# EAGLE design PortableWiFiRepeaterUSBPowerOnly (EAGLE 9.6.2)
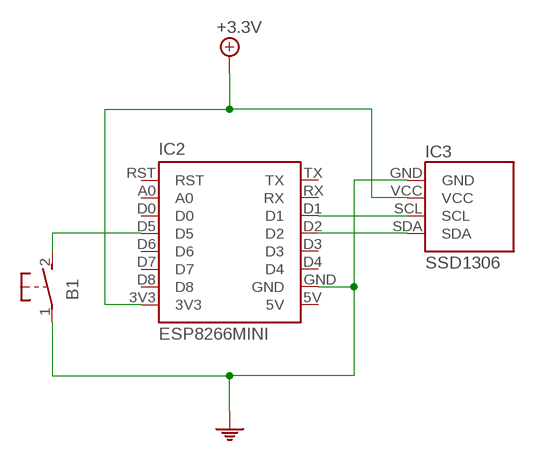
[diagram p0: schematic, sheet 1]

## Parts
B1  BUTTONSIL2  [SIL2]
IC2  ESP8266MINI  [ESP8266MINI]
IC3  SSD1306  [SSD1306]

## Nets
+3.3V: IC2.3V3 IC3.VCC
GND: B1.1(P) IC2.GND IC3.GND
N$2: B1.2(S) IC2.D5
N$3: IC2.D1 IC3.SCL
N$4: IC2.D2 IC3.SDA
Unconnected: IC2.A0 IC2.D0 IC2.D3 IC2.D4 IC2.D6 IC2.D7 IC2.D8 IC2.RST IC2.RX IC2.TX

## Power pins joined to a net without a drawn wire
5V: IC2.5V

## Library data of the parts
B1 = wizzent:BUTTON: Button
IC2 = wizzent:ESP8266MINI: ESP8266 Mini
IC3 = wizzent:SSD1306: SSD1306

## Board
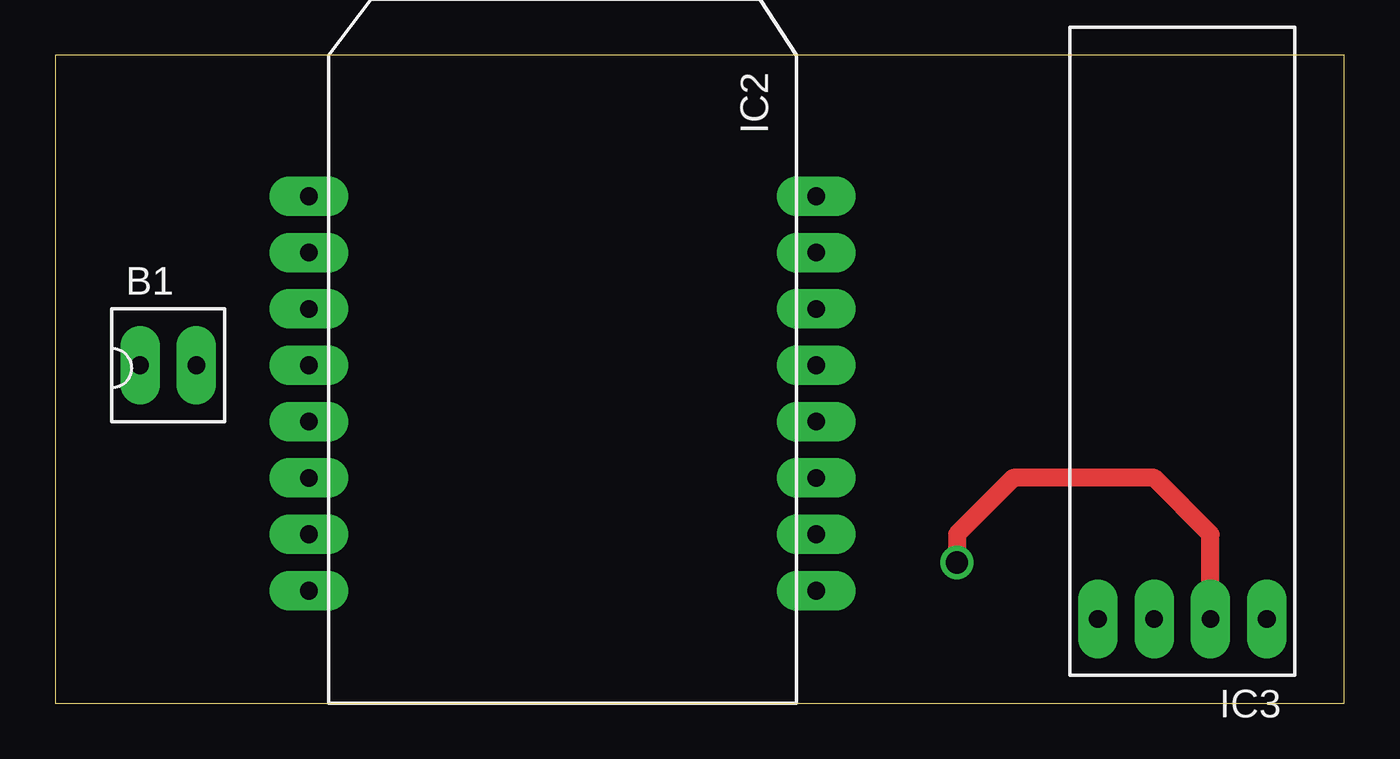
[diagram p1: board, top side]
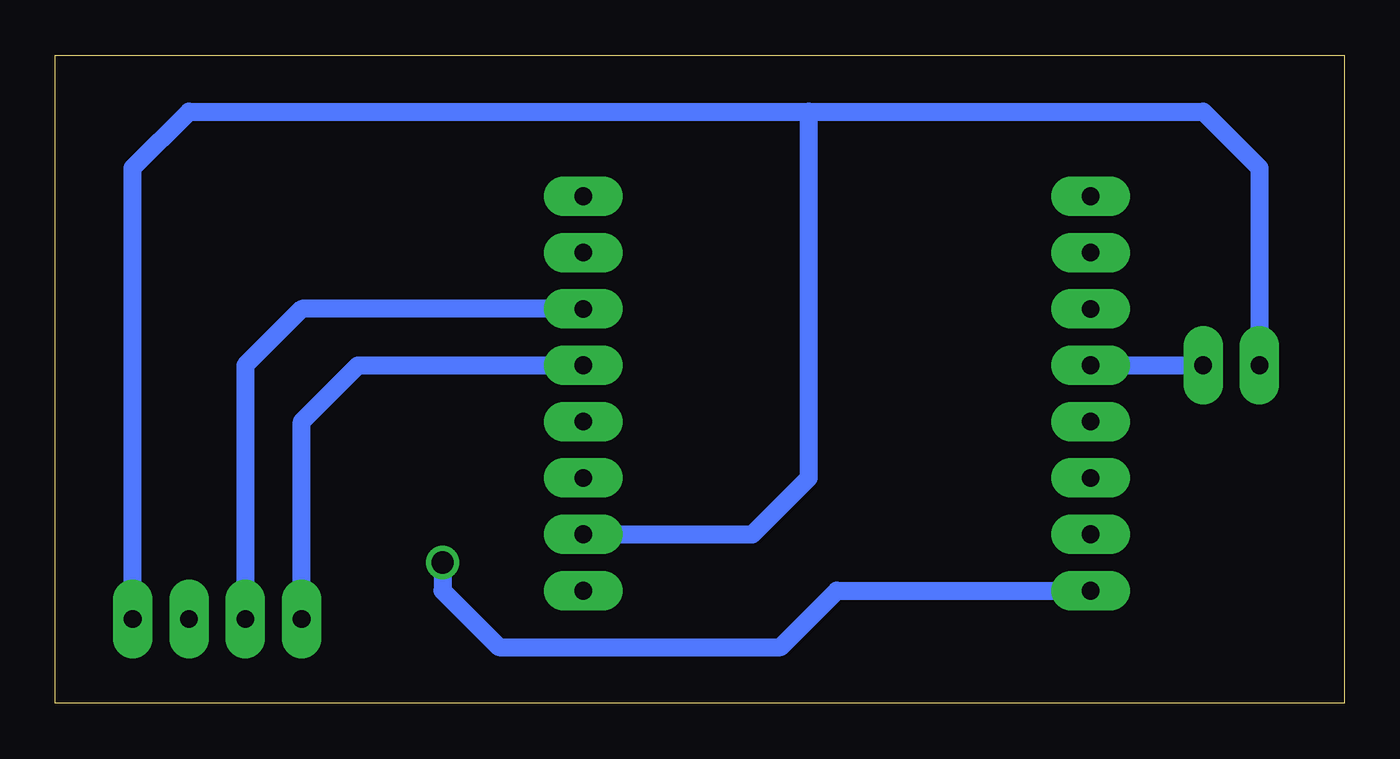
[diagram p2: board, bottom side, seen from below]

Size 58.09 x 29.2 mm. Coordinates in mm from the lower left corner, seen from the top.
Outline: 0,0 58.09,0 58.09,29.2 0,29.2 0,0
Copper layers (1*16): Top 0.035mm / dielectric 1.5mm / Bottom 0.035mm
Design rules "default": minimum track width 6mil, minimum drill 0.35mm, track to track 6mil, track to pad 6mil, pad to pad 6mil, via to via 6mil, smd to smd 6mil, copper to edge 40mil, drill to drill 6mil, minimum pad ring 10mil, minimum via ring 8mil, stop-mask expansion 4mil, vias tented up to drill 0mil, thermal gap 10mil

### Footprints (pad centres in the part's own frame; a part is rotated, then mirrored left to right if it is on the bottom)
SIL2 = drill 0.8 pad 1.778 long: 1 0,0; 2 2.54,0
ESP8266MINI = drill 0.8 pad 1.778 long: 3V3 17.78,0; 5V 17.78,22.86; A0 2.54,0; D0 5.08,0; D1 5.08,22.86; D2 7.62,22.86; D3 10.16,22.86; D4 12.7,22.86; D5 7.62,0; D6 10.16,0; D7 12.7,0; D8 15.24,0; GND 15.24,22.86; RST 0,0; RX 2.54,22.86; TX 0,22.86
SSD1306 = drill 0.8 pad 1.778 long: GND 0,0; SCL 5.08,0; SDA 7.62,0; VCC 2.54,0

### Placement (x,y rotation side)
B1  3.81,15.24 0 top
IC2  11.43,22.86 270 top
IC3  54.61,3.81 180 top

### Tracks (layer width: path | path; a pad name or v marks a point on that pad's centre or on a via)
+3.3V  (via drill 1)
  Top 0.813: IC3.VCC 52.07,7.62 49.53,10.16 43.18,10.16 40.64,7.62 v40.64,6.35
  Bottom 0.813: v40.64,6.35 40.64,5.08 38.1,2.54 25.4,2.54 22.86,5.08 IC2.3V3
GND
  Bottom 0.813: IC3.GND 54.61,24.13 52.07,26.67 24.13,26.67 | 24.13,26.67 6.35,26.67 3.81,24.13 B1.1 | IC2.GND 26.67,7.62 24.13,10.16 24.13,26.67
N$2
  Bottom 0.813: IC2.D5 B1.2
N$3
  Bottom 0.813: IC2.D1 46.99,17.78 49.53,15.24 IC3.SCL
N$4
  Bottom 0.813: IC3.SDA 46.99,12.7 44.45,15.24 IC2.D2